# EAGLE design esp_heart (EAGLE 9.3.0)
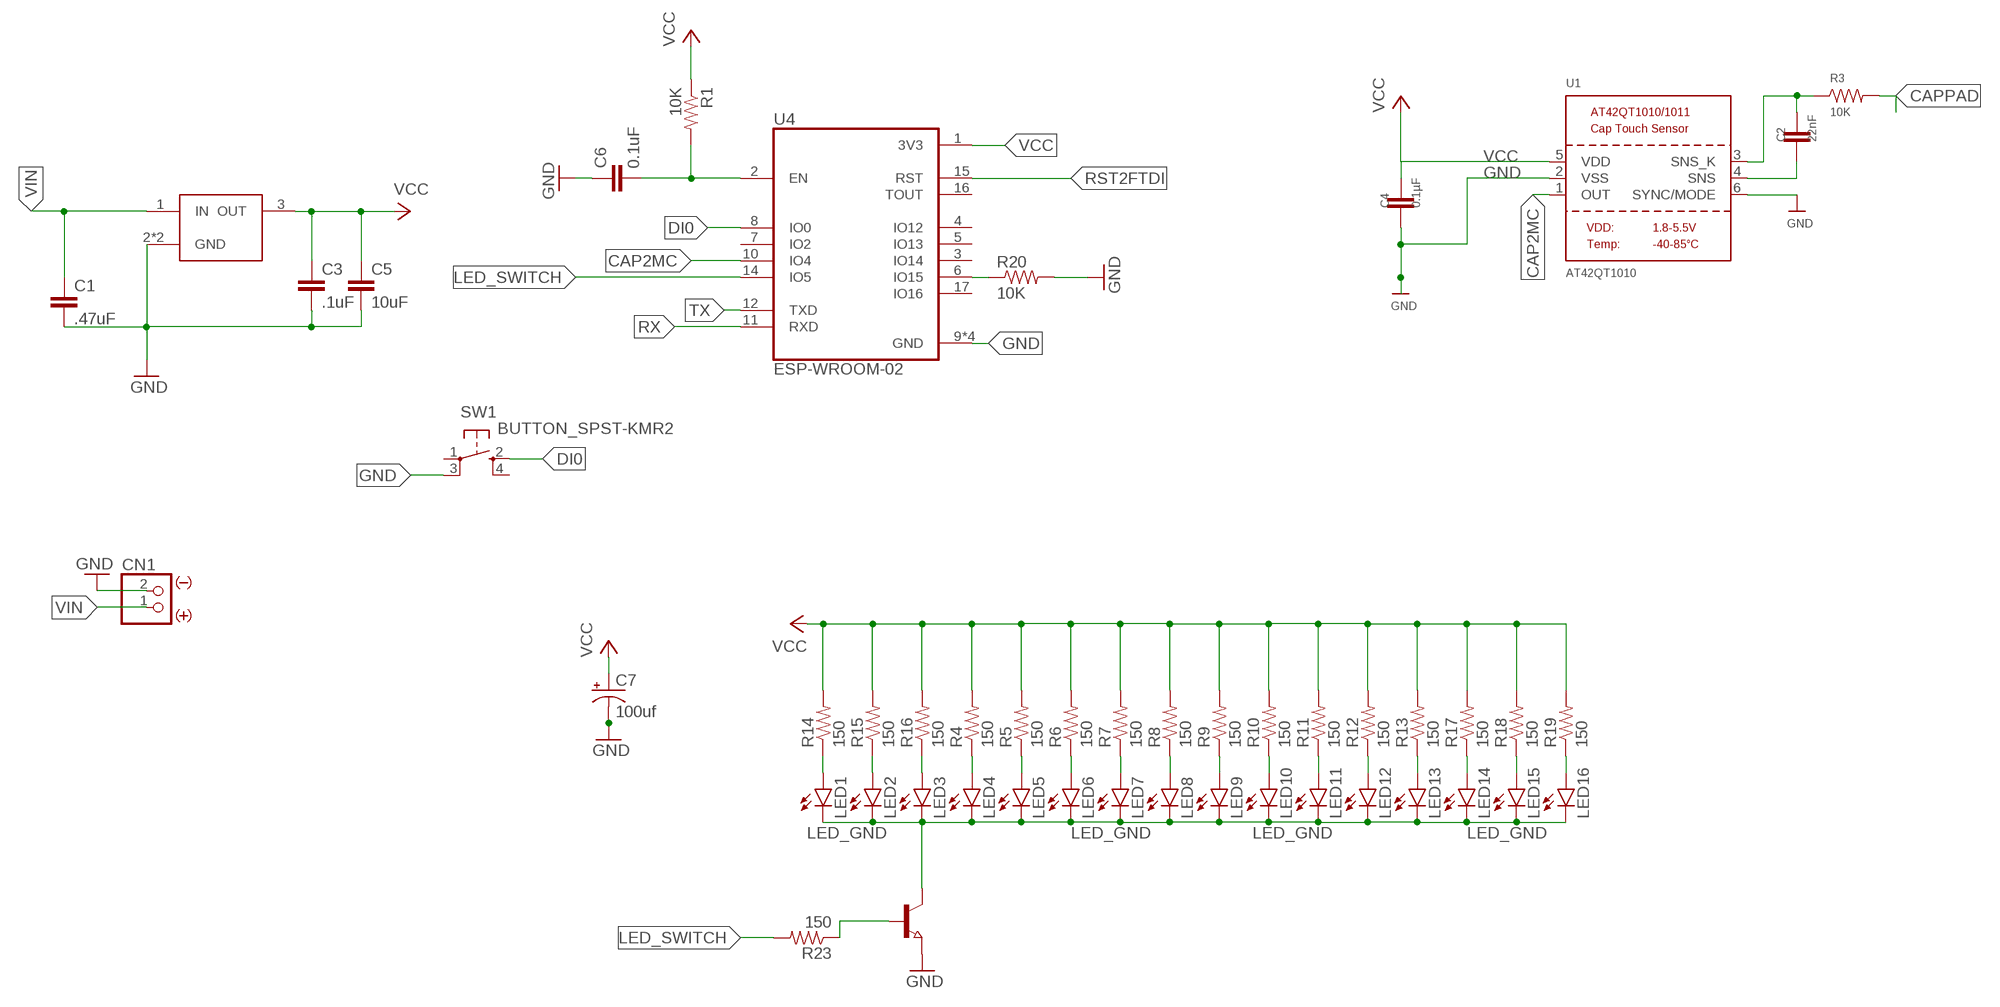
[diagram p0: schematic, sheet 1]

## Parts
C1  .47uF  CAP-0805  [0805]
C2  22nF  CAP-0805  [0805]
C3  .1uF  CAP-0805  [0805]
C4  0.1µF  CAP-0805  [0805]
C5  10uF  CAP-0805  [0805]
C6  0.1uF  CAP-0805  [0805]
C7  100uf  CAP_POLD  [PANASONIC_D]
CN1  JST_2PIN_BATTERY-SMT-HORIZ  [JST-PH-2-SMT-RA]
LED1  LED0603  [LED-0603]
LED2  LED0603  [LED-0603]
LED3  LED0603  [LED-0603]
LED4  LED0603  [LED-0603]
LED5  LED0603  [LED-0603]
LED6  LED0603  [LED-0603]
LED7  LED0603  [LED-0603]
LED8  LED0603  [LED-0603]
LED9  LED0603  [LED-0603]
LED10  LED0603  [LED-0603]
LED11  LED0603  [LED-0603]
LED12  LED0603  [LED-0603]
LED13  LED0603  [LED-0603]
LED14  LED0603  [LED-0603]
LED15  LED0603  [LED-0603]
LED16  LED0603  [LED-0603]
Q5  TRANSISTOR-NPN-SOT23  [SOT23]
R1  10K  RESISTOR-0805  [0805]
R3  10K  RESISTOR-0805  [0805]
R4  150  RESISTOR0603  [0603-RES]
R5  150  RESISTOR0603  [0603-RES]
R6  150  RESISTOR0603  [0603-RES]
R7  150  RESISTOR0603  [0603-RES]
R8  150  RESISTOR0603  [0603-RES]
R9  150  RESISTOR0603  [0603-RES]
R10  150  RESISTOR0603  [0603-RES]
R11  150  RESISTOR0603  [0603-RES]
R12  150  RESISTOR0603  [0603-RES]
R13  150  RESISTOR0603  [0603-RES]
R14  150  RESISTOR0603  [0603-RES]
R15  150  RESISTOR0603  [0603-RES]
R16  150  RESISTOR0603  [0603-RES]
R17  150  RESISTOR0603  [0603-RES]
R18  150  RESISTOR0603  [0603-RES]
R19  150  RESISTOR0603  [0603-RES]
R20  10K  RESISTOR-0805  [0805]
R23  150  RESISTOR-0805  [0805]
SW1  BUTTON_SPST-KMR2  [KMR2]
U1  AT42QT1010  AT42QT1010/1  [SOT23-6]
U4  ESP-WROOM-02  [MODULE_ESP-WROOM-02]
U$1  REGULATOR3.3V-0.5A-UA78M33CDCYR  [SOT223]

## Nets
CAP2MC: U1.1(OUT) U4.10(IO4)
CAPPAD: R3.2
DI0: SW1.2(S) U4.8(IO0)
GND: C1.2 C3.2 C4.2 C5.2 C6.1 C7.- CN1.2 Q5.2(E) R20.2 SW1.3(P1) U1.2(VSS) U1.6(SYNC/MODE) U4.9(GND) U4.13(GND) U4.18(GND) U4.19(GND) U$1.2(GND) U$1.4(GND)
LED_GND: LED1.C LED2.C LED3.C LED4.C LED5.C LED6.C LED7.C LED8.C LED9.C LED10.C LED11.C LED12.C LED13.C LED14.C LED15.C LED16.C Q5.3(C)
LED_SWITCH: R23.2 U4.14(IO5)
N$1: LED4.A R4.1
N$3: C6.2 R1.2 U4.2(EN)
N$4: LED15.A R18.1
N$5: LED1.A R14.1
N$6: LED2.A R15.1
N$7: LED5.A R5.1
N$8: LED6.A R6.1
N$9: LED7.A R7.1
N$10: LED8.A R8.1
N$11: LED9.A R9.1
N$12: LED10.A R10.1
N$13: LED11.A R11.1
N$14: LED12.A R12.1
N$15: LED13.A R13.1
N$16: LED3.A R16.1
N$18: R20.1 U4.6(IO15)
N$20: LED16.A R19.1
N$22: LED14.A R17.1
N$23: Q5.1(B) R23.1
N$26: C2.2 U1.4(SNS)
N$27: C2.1 R3.1 U1.3(SNS_K)
RST2FTDI: U4.15(RST)
RX: U4.11(RXD)
TX: U4.12(TXD)
VCC: C3.1 C4.1 C5.1 C7.+ R1.1 R4.2 R5.2 R6.2 R7.2 R8.2 R9.2 R10.2 R11.2 R12.2 R13.2 R14.2 R15.2 R16.2 R17.2 R18.2 R19.2 U1.5(VDD) U4.1(3V3) U$1.3(OUT)
VIN: C1.1 CN1.1 U$1.1(IN)
Unconnected: SW1.1(P) SW1.4(S1) U4.3(IO14) U4.4(IO12) U4.5(IO13) U4.7(IO2) U4.16(TOUT) U4.17(IO16)

## Library data of the parts
C1-C6 = homemade-hardware:CAP: Capacitor Standard 0603 ceramic capacitor, and 0.1" leaded capacitor.
C7 = homemade-hardware:CAP_POL: Capacitor Polarized These are standard SMD and PTH capacitors. Normally 10uF, 47uF, and 100uF in electrolytic and tantalum varieties. Always verify the external diameter of the through hole cap, it varies with capacity, voltage, and manufacturer. The EIA devices should be standard.
CN1 = homemade-hardware:JST_2PIN_BATTERY: JST 2-Pin Connectors of various flavors SMT-HORIZ (S2B-PH-SM4) SMT-VERT (B2B-PH-SM4) DIP-HORIZ (S2B-PH) DIP-VERT (B2B-PH)
LED1-LED16 = homemade-hardware:LED: LEDs Standard schematic elements and footprints for 5mm, 3mm, 1206, and 0603 sized LEDs. 5mm - Spark Fun Electronics SKU : COM-00529 (and others)
Q5 = homemade-hardware:TRANSISTOR-NPN: NPN Transistor BJT <https://www.digikey.com/product-detail/en/micro-commercial-co/MMBT2222A-TP/MMBT2222ATPMSCT-ND/717394>: MMBT2222A
R1 R3-R20 R23 = homemade-hardware:RESISTOR: Resistor Basic schematic elements and footprints for 0603, 1206, and PTH resistors.
SW1 = homemade-hardware:BUTTON_SPST: KMR221GLFS <https://www.digikey.com/products/en/switches/tactile-switches/197?k=KMR221GLFS&k=&pkeyword=KMR221GLFS&sv=0&pv7=2&sf=0&quantity=&ColumnSort=0&page=1&pageSize=25>: Momentary Button PTS647 <https://www.digikey.com/product-detail/en/c-k/PTS-647-SN38-SMTR2-LFS/PTS647SN38SMTR2LFSTR-ND/9649860>: Momentary Button
U1 = microbuilder:AT42QT1010/1: AT42QT1010/1011 - Single Button Cap Touch Sensors AT42QT1010 - Auto recalibration AT42QT1011 - Remains on as long as touch is detected
U4 = ESP-WROOM-02:ESP-WROOM-02: Wi-Fi Module w/ESP8266 802.11b/g/n 20dBm 20x18x3mm; AVAILABILITY: Unavailable; DESCRIPTION: Wi-Fi Module w/ESP8266 802.11b/g/n 20dBm 20x18x3mm; MF: Espressif Systems; MP: ESP-WROOM-02; PACKAGE: SMD-18 Espressif Systems; PRICE: None
U$1 = homemade-hardware:REGULATOR: MC7805CTG <https://www.digikey.com/product-detail/en/on-semiconductor/MC7805CTG/MC7805CTGOS-ND/919333>: 5V/1A DIP Linear Regulator UA78M33CDCYR <https://www.digikey.com/product-detail/en/texas-instruments/UA78M33CDCYR/296-13424-1-ND/484495>: 3.3V/0.5A SMD Linear Regulator MIC5219-5.0YM5-TR <https://www.digikey.com/products/en/integrated-circuits-ics/pmic-voltage-regulators-linear/699?k=MIC5219-5.0YM5-TR&k=&pkeyword=MIC5219-5.0YM5-TR&sv=0&pv7=2&sf=0&quantity=&ColumnSort=0&page=1&pageSize=25>: 5V/0.5A SMD Linear Regulator MIC5219-3.3YM5-TR <https://www.digikey.com/products/en/integrated-circuits-ics/pmic-voltage-regulators-linear/699?k=MIC5219-3.3YM5-TR&k=&pkeyword=MIC5219-3.3YM5-TR&sv=0&pv7=2&sf=0&quantity=&ColumnSort=0&page=1&pageSize=25>: 3.3V/0.5A SMD Linear Regulator

## Board
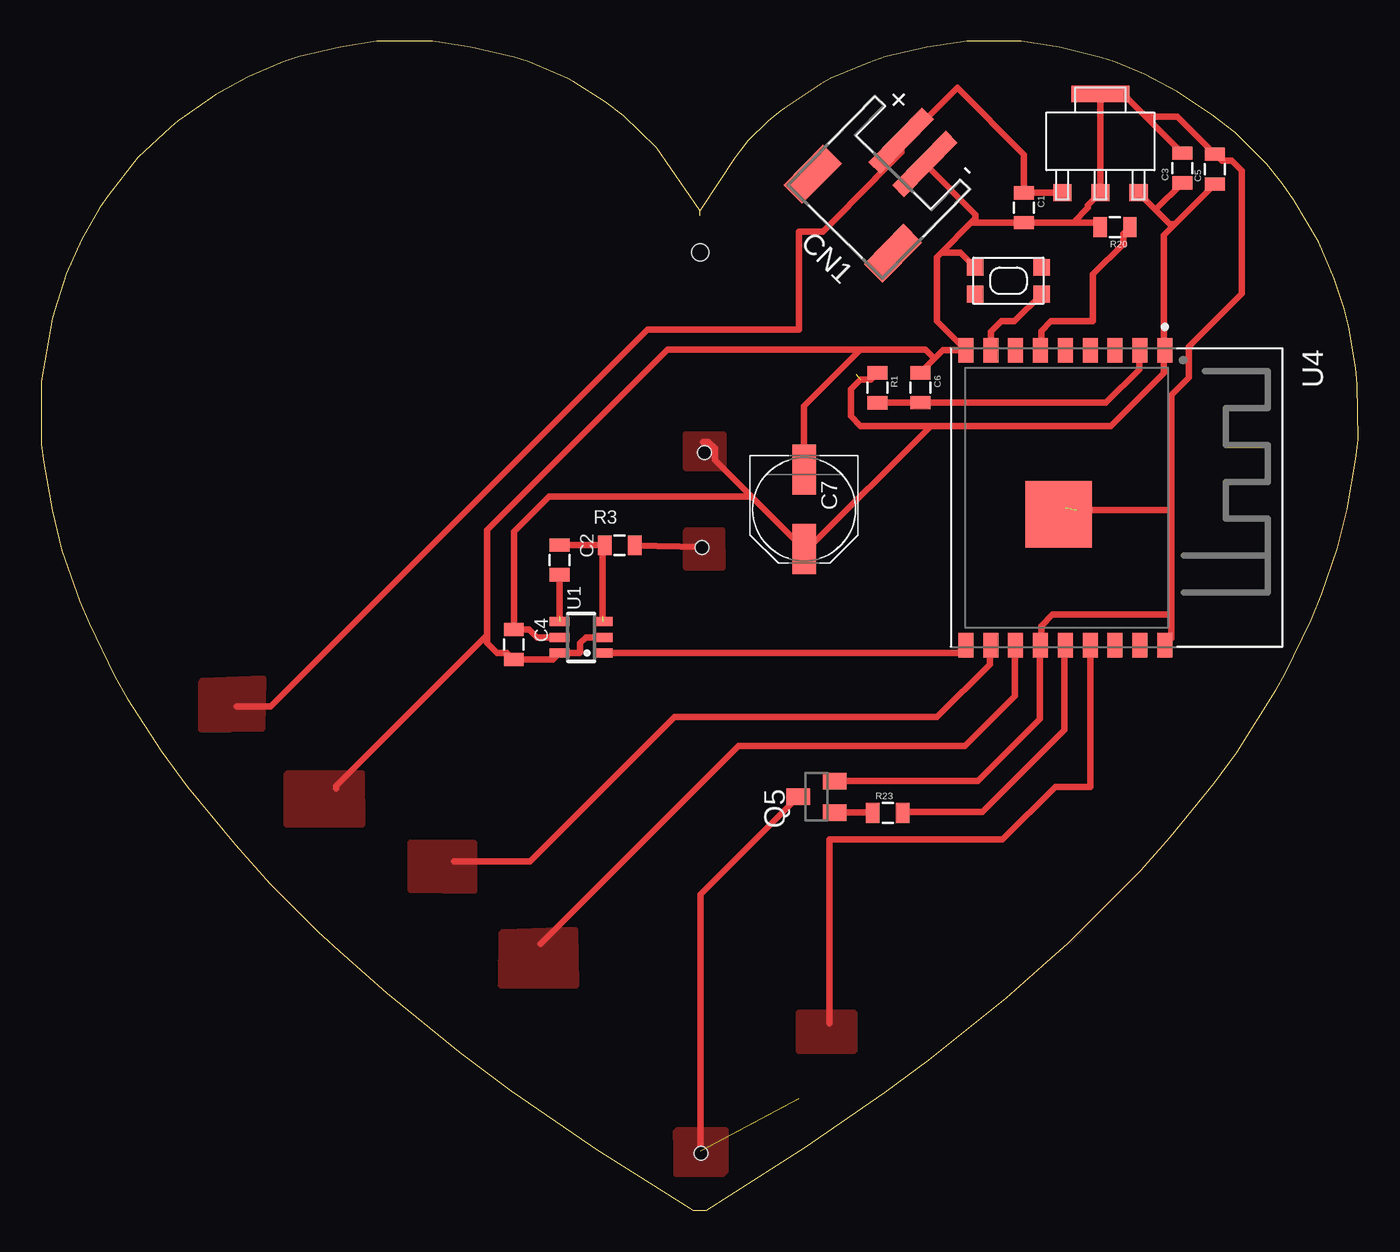
[diagram p1: board, top side]
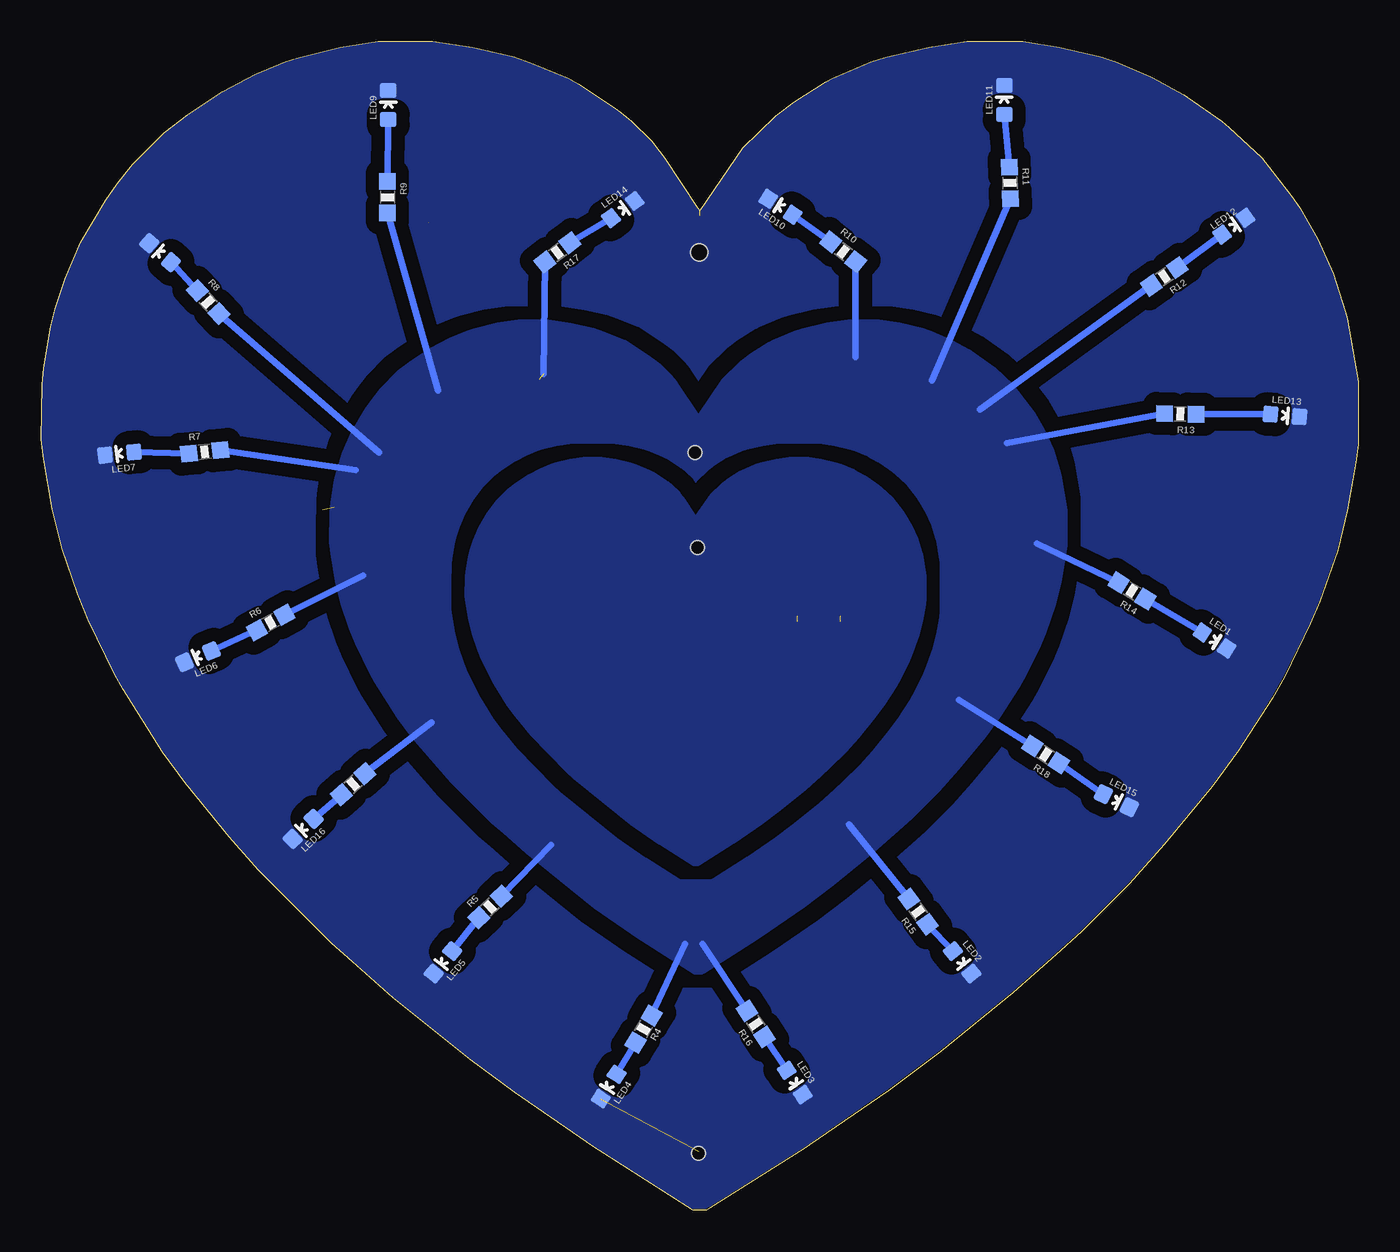
[diagram p2: board, bottom side, seen from below]

Size 79.4 x 70.5 mm. Coordinates in mm from the lower left corner, seen from the top.
Outline: 39.7,60 39.7,60.3
Outline: 39.7,60.3 37.1,64.1 35.12,66.02 33.98,66.88 32.09,68.08 31.69,68.28 29.39,69.27 28.51,69.53 25.89,70.16 23.6,70.5 20.2,70.5 18.01,70.16 15.51,69.56 14.61,69.27 12.51,68.38 12.39,68.32 10.51,67.28 10.29,67.12 8.22,65.68 7.78,65.32 5.8,63.5 4.02,61.19 3.52,60.48 2.42,58.59 1.48,56.51 0.77,54.21 0.64,53.79 0,50 0,46.2 0.14,45.1 0.63,42.21 1.23,39.81 2.32,36.71 2.88,35.39 4.42,32.22 5.18,30.89 7.22,27.72 8.78,25.58 11.67,22.08 13.8,19.7 16.7,16.8 18.22,15.43 20.82,13.12 25.18,9.58 28.32,7.22 33.12,3.92 33.41,3.72 39.11,0.12 39.19,0.08 39.3,0 40.1,0 45.78,3.62 46.02,3.78 50.88,7.12 53.52,9.08 58.18,12.82 60.62,14.97 61.9,16.1 66.3,20.5 68.08,22.52 70.72,25.78 72.08,27.62 74.48,31.42 74.98,32.32 76.58,35.61 77.22,37.19 78.14,39.89 78.77,42.31 79.25,45.3 79.4,46.5 79.34,49.8 79.25,50.8 78.84,53.31 78.56,54.39 77.98,56.19 77.02,58.41 75.52,60.92 74.82,61.92 73.9,63.1 72,65 70.58,66.08 68.49,67.48 66.51,68.52 64.69,69.27 63.91,69.53 61.39,70.16 59.1,70.5 55.8,70.5 53.39,70.14 50.91,69.56 49.89,69.23 47.61,68.28 46.99,67.92 44.82,66.48 44.48,66.22 43.8,65.7 42.6,64.5 42.12,63.88 41.82,63.48 39.82,60.48 39.7,60.3
Copper layers (1*16): Top 0.035mm / dielectric 1.5mm / Bottom 0.035mm
Design rules "default": minimum track width 16mil, minimum drill 0.8mm, track to track 0.8mm, track to pad 0.8mm, pad to pad 0.8mm, via to via 0.8mm, smd to smd 0mil, copper to edge 1mil, drill to drill 1mil, minimum pad ring 10mil, minimum via ring 10mil, stop-mask expansion 1mil, vias tented up to drill 30mil, thermal gap 10mil
Holes 0.8 mm at 39.76,3.45 39.85,39.97 39.98,45.72
Holes 1 mm at 39.73,57.77

### Footprints (pad centres in the part's own frame; a part is rotated, then mirrored left to right if it is on the bottom)
0805 = smd 0.8 x 1.2: 1 -0.9,0; 2 0.9,0
PANASONIC_D = smd 3 x 1.4: + 2.4,0; - -2.4,0
JST-PH-2-SMT-RA = smd 1 x 4.6: 1 1,-3.7; 2 -1,-3.7 | smd 1.6 x 3.4: NC1 -3.4,1.5; NC2 3.4,1.5
LED-0603 = smd 1 x 0.9: A 0,-0.877; C 0,0.877
SOT23 = smd 1 x 1.4: 1 -0.95,-1.1; 2 0.95,-1.1; 3 0,1.1
0603-RES = smd 1 x 1: 1 -0.95,0; 2 0.95,0
KMR2 = smd 1 x 1: 1 2,0.8; 2 2,-0.8; 3 -2,0.8; 4 -2,-0.8
SOT23-6 = smd 0.55 x 1.2: 1 -0.95,-1.3; 2 0,-1.3; 3 0.95,-1.3; 4 0.95,1.3; 5 0,1.3; 6 -0.95,1.3
MODULE_ESP-WROOM-02 = smd 1.485 x 0.9: 1 -8.893,4.9; 2 -8.893,3.4; 3 -8.893,1.9; 4 -8.893,0.4; 5 -8.893,-1.1; 6 -8.893,-2.6; 7 -8.893,-4.1; 8 -8.893,-5.6; 9 -8.893,-7.1; 10 8.893,-7.1; 11 8.893,-5.6; 12 8.893,-4.1; 13 8.893,-2.6; 14 8.893,-1.1; 15 8.893,0.4; 16 8.893,1.9; 17 8.893,3.4; 18 8.893,4.9 | smd 4 x 4: 19 1,-1.5
SOT223 = smd 1.1 x 1: 1 -2.3,-3.1; 2 0,-3.1; 3 2.3,-3.1 | smd 3.5 x 1: 4 0,2.85

### Placement (x,y rotation side)
C1  59.26,60.47 270 top
C2  31.24,39.23 270 top
C3  68.8,62.87 90 top
C4  28.49,34.13 270 top
C5  70.77,62.8 90 top
C6  53.02,49.62 270 top
C7  45.99,42.28 270 top
CN1  49.98,61.18 135.5 top
LED1  8.66,34.38 237 bottom
LED2  23.87,14.96 219.5 bottom
LED3  33.97,7.72 213.5 bottom
LED4  45.19,7.47 146.8 bottom
LED5  55.19,14.96 140.4 bottom
LED6  69.97,33.4 113 bottom
LED7  74.69,45.64 96.1 bottom
LED8  72.25,57.76 48.7 bottom
LED9  58.49,66.66 0 bottom
LED10  34.84,60.53 56.7 bottom
LED11  21.34,66.97 0 bottom
LED12  7.49,59.37 305.2 bottom
LED13  4.4,47.94 265 bottom
LED14  44.34,60.37 305.9 bottom
LED15  14.57,24.71 243.5 bottom
LED16  63.62,23.01 133.9 bottom
Q5  46.73,24.95 90 top
R1  50.41,49.61 270 top
R3  34.87,40.11 0 top
R4  43.09,10.94 59.4 bottom
R5  52.35,18.3 43.9 bottom
R6  65.59,35.46 28.9 bottom
R7  69.55,45.75 5.9 bottom
R8  69.35,54.78 313.1 bottom
R9  58.53,61.1 270 bottom
R10  31.05,57.82 321.6 bottom
R11  21,61.97 271.8 bottom
R12  11.68,56.33 214.3 bottom
R13  10.72,48.04 179 bottom
R14  13.63,37.37 148.7 bottom
R15  26.52,18.02 126.3 bottom
R16  36.32,11.25 123.7 bottom
R17  48.28,57.78 217.4 bottom
R18  18.84,27.49 147 bottom
R19  60.6,25.71 42.1 bottom
R20  64.74,59.3 180 top
R23  51.04,23.96 0 top
SW1  58.32,56.06 0 top
U1  32.55,34.56 90 top
U4  62.85,42.98 270 top
U$1  63.86,64.48 0 top

### Tracks (layer width: path | path; a pad name or v marks a point on that pad's centre or on a via)
CAP2MC
  Top 0.406: U4.10 55.27,33.61 U1.1
CAPPAD
  Top 0.406: R3.2 39.87,40
  pour Bottom: 26.05,38.27 26.05,36.94 26.1,36.55 26.27,35.54 26.48,34.7 26.86,33.61 27.06,33.15 27.6,32.04 27.86,31.58 28.58,30.47 29.12,29.72 30.14,28.49 30.88,27.66 31.9,26.65 32.43,26.16 33.34,25.36 34.86,24.12 35.96,23.29 37.64,22.14 37.75,22.07 39.74,20.81 39.77,20.79 39.81,20.77 40.09,20.77 42.08,22.03 42.16,22.09 43.86,23.26 47.27,26.01 47.72,26.4 49.88,28.65 50.8,29.79 51.28,30.43 52.12,31.76 52.29,32.08 52.85,33.23 53.08,33.78 53.4,34.73 53.62,35.57 53.79,36.62 53.84,37.04 53.82,38.2 53.79,38.54 53.64,39.42 53.55,39.8 53.34,40.43 53.01,41.21 52.48,42.09 52.24,42.44 51.92,42.85 51.25,43.52 50.75,43.89 50.02,44.38 49.33,44.75 48.69,45.01 48.42,45.1 47.54,45.32 46.74,45.44 45.58,45.44 44.74,45.32 43.87,45.11 43.51,45 42.71,44.66 42.5,44.54 41.74,44.03 41.62,43.94 41.38,43.76 40.96,43.34 40.79,43.12 40.69,42.98 39.99,41.93 39.95,41.87 39.04,43.2 38.34,43.87 37.94,44.17 37.28,44.59 37.14,44.66 36.34,45.01 36.03,45.1 35.11,45.32 34.31,45.44 33.12,45.44 32.35,45.32 31.48,45.11 31.16,45.01 30.43,44.7 30.39,44.68 29.73,44.31 29.65,44.26 28.93,43.75 28.77,43.63 28.08,42.99 27.46,42.18 27.28,41.93 26.9,41.27 26.57,40.54 26.32,39.74 26.27,39.59
  pour Top: 38.89,40.93 38.89,38.76 41.06,38.78 41.03,41.03 38.91,41.01
DI0
  Top 0.406: SW1.2 58.68,53.62 57.88,53.62 57.25,52.99 U4.8
GND  (2 unrouted)
  Top 0.406: U$1.4 63.86,67.09 | 63.86,67.09 U$1.2 63.11,60.63 63.11,60.47 62.22,59.57 | C3.2 66.6,65.96 | 66.6,65.96 65.47,67.09 63.86,67.09 | 66.6,65.96 68.51,65.96 C5.2 71.17,63.3 71.79,63.3 72.38,62.72 72.38,55.28 69.2,52.1 69.2,50.23 68.15,49.18 68.15,42.25 | 62.22,59.57 C1.2 56.06,59.57 54.26,57.78 | 56.06,59.58 56.34,59.85 56.34,60.06 CN1.2 | 54.26,57.78 53.99,57.5 53.99,53.63 U4.9 54.37,51.88 53.87,51.37 | 62.22,59.57 63.57,59.57 R20.2 | U4.19 61.74,42.38 | Q5.2 56.47,25.9 60.2,29.63 60.2,34.05 U4.13 60.29,34.14 60.29,35.25 60.97,35.93 68.15,35.93 | U4.18 68.15,34.5 68.15,35.93 | U1.2 32.83,34.56 32.49,34.22 32.49,33.67 32.44,33.61 U1.6 30.87,33.23 C4.2 28.09,33.63 27.47,33.63 26.89,34.21 26.89,34.71 | 53.87,51.37 C6.1 | 68.15,42.25 68.15,35.93 | SW1.3 55.41,57.78 54.26,57.78 | 49.39,51.92 45.99,48.52 C7.- | 49.39,51.92 53.32,51.92 53.87,51.37 | 26.89,34.71 26.89,41.04 37.76,51.92 49.39,51.92 | 26.89,34.71 17.77,25.59 17.77,25.45 | 68.15,42.25 62.44,42.25
  pour Top: 14.79,26.28 14.79,23.29 19.34,23.29 19.3,26.38 14.86,26.35
LED_GND  (1 unrouted)
  Top 0.406: Q5.3 39.74,19.06 39.74,3.58
  pour Bottom (rank 3, no thermals): 0.04,50.1 0.04,46.3 0.19,45.2 0.68,42.3 1.28,39.9 2.36,36.8 2.92,35.49 4.46,32.31 5.22,30.99 7.26,27.81 8.82,25.68 11.72,22.17 13.84,19.79 16.74,16.89 18.26,15.52 20.86,13.22 25.22,9.67 28.36,7.32 33.16,4.02 33.46,3.82 39.15,0.22 39.23,0.18 39.34,0.1 40.14,0.1 45.82,3.72 46.06,3.87 50.92,7.22 53.56,9.17 58.22,12.92 60.66,15.07 61.94,16.2 66.34,20.59 68.12,22.62 70.76,25.88 72.12,27.71 74.52,31.51 75.02,32.41 76.62,35.71 77.26,37.29 78.18,39.99 78.8,42.4 79.29,45.4 79.44,46.6 79.39,49.9 79.29,50.89 78.88,53.4 78.6,54.49 78.02,56.29 77.06,58.51 75.56,61.01 74.86,62.01 73.94,63.2 72.04,65.09 70.62,66.17 68.53,67.58 66.55,68.62 64.73,69.37 63.95,69.62 61.43,70.25 59.14,70.59 55.84,70.59 53.43,70.24 50.95,69.66 49.93,69.33 47.65,68.38 47.03,68.02 44.86,66.57 44.52,66.32 43.84,65.8 42.64,64.59 42.16,63.97 41.86,63.58 39.86,60.58 39.74,60.39 37.14,64.2 35.16,66.12 34.02,66.97 32.13,68.17 31.73,68.38 29.43,69.37 28.55,69.63 25.93,70.25 23.64,70.59 20.24,70.59 18.05,70.25 15.55,69.66 14.65,69.37 12.55,68.48 12.43,68.42 10.56,67.37 10.32,67.22 8.26,65.77 7.82,65.42 5.84,63.59 4.06,61.28 3.56,60.58 2.46,58.69 1.52,56.61 0.8,54.3 0.68,53.89
  pour Top: 38.3,4.2 38.3,2.24 38.27,2.21 41.1,2.21 41.26,2.37 41.26,4.82 38.36,4.82 38.27,4.73 38.27,4.32 38.33,4.26
LED_SWITCH
  Top 0.406: R23.2 51.94,24.02 56.75,24.02 61.7,28.97 61.7,34.05 U4.14
N$1
  Bottom 0.406: LED4.A R4.1
N$3
  Top 0.406: U4.2 66.2,51.83 66.2,50.72 64.2,48.72 C6.2 R1.2
N$4
  Bottom 0.406: LED15.A R18.1
N$5
  Bottom 0.406: LED1.A R14.1
N$6
  Bottom 0.406: LED2.A R15.1
N$7
  Bottom 0.406: LED5.A R5.1
N$8
  Bottom 0.406: LED6.A R6.1
N$9
  Bottom 0.406: LED7.A R7.1
N$10
  Bottom 0.406: LED8.A R8.1
N$11
  Bottom 0.406: LED9.A R9.1
N$12
  Bottom 0.406: LED10.A R10.1
N$13
  Bottom 0.406: LED11.A R11.1
N$14
  Bottom 0.406: LED12.A R12.1
N$15
  Bottom 0.406: LED13.A R13.1
N$16
  Bottom 0.406: LED3.A R16.1
N$18
  Top 0.406: 60.2,51.83 U4.6 60.29,51.92 60.29,53.04 60.88,53.62 63.42,53.62 63.42,56.46 65.25,58.28 65.25,58.9 R20.1
N$20
  Bottom 0.406: LED16.A R19.1
N$22
  Bottom 0.406: LED14.A R17.1
N$23
  Top 0.406: R23.1 50.1,24 Q5.1
N$26  (1 unrouted)
  Top 0.406: C2.2 31.24,35.85 31.25,35.84
N$27  (1 unrouted)
  Top 0.406: 33.85,35.84 33.85,39.99 R3.1 33.95,40.13 C2.1
RST2FTDI
  Top 0.406: U4.15 63.25,25.55 61.15,25.55 57.96,22.36 47.51,22.36 47.51,11.28
  pour Top: 45.69,11.85 45.69,9.62 45.7,9.62 48.99,9.62 48.99,9.65 48.99,11.92 48.95,11.92 45.7,11.92 45.7,11.86
RX
  Top 0.406: U4.11 57.2,34.05 57.2,32.93 54.02,29.75 38.17,29.75 29.47,21.05 24.9,21.05
  pour Top: 22.27,22.16 22.27,19.32 26.1,19.26 26.1,22.16 22.33,22.19
TX
  Top 0.406: U4.12 58.7,34.05 58.7,31.03 55.68,28.01 42.04,28.01 30.1,16.07
  pour Top: 27.75,16.71 27.71,13.59 32.23,13.59 32.19,16.91 27.81,16.78
VCC  (1 unrouted)
  Top 0.406: U$1.3 67.16,60.39 | 67.16,60.39 68.06,59.48 | 68.06,59.48 68.2,59.35 | C3.1 67.22,60.39 67.16,60.39 | C5.1 68.35,59.48 | 68.35,59.48 68.06,59.48 | U1.5 29.88,34.56 29.41,35.03 C4.1 28.49,40.93 30.6,43.05 42.83,43.05 | R1.1 50.01,50.12 49.39,50.12 48.8,49.53 48.8,47.9 49.39,47.31 53.63,47.31 | U4.1 67.7,51.83 | 67.7,51.83 67.7,50.51 64.5,47.31 53.63,47.31 | 68.35,59.48 67.7,58.83 67.7,51.83 | 46.51,40.4 C7.+ | C7.+ 46.2,39.88 53.63,47.31 | 39.9,46.35 40.24,46.35 40.61,45.98 40.61,45.27 42.83,43.05 | C7.+ 42.83,43.05
  Bottom 0.406: R10.2 30.3,51.49 30.31,51.48 | R11.2 25.7,50.04 | R12.2 22.82,48.3 | R13.2 21.18,46.28 | R14.2 19.36,40.22 | R18.2 24.07,30.79 | R15.2 30.7,23.28 | R16.2 39.54,16.07 | R4.2 40.6,16.07 | R5.2 48.67,22.03 | R19.2 55.88,29.44 | R6.2 60.01,38.3 | R8.2 59.05,45.7 | R9.2 55.49,49.46 | R17.2 49.13,50.44 | R7.2 60.44,44.65
  pour Bottom (rank 2): 17.56,42.24 17.56,40.11 17.64,39.5 17.91,37.88 18.25,36.53 18.86,34.8 19.17,34.06 20.03,32.28 20.46,31.54 21.6,29.76 22.47,28.57 24.1,26.6 25.28,25.27 26.91,23.65 27.76,22.88 29.22,21.59 31.66,19.6 33.42,18.29 36.1,16.44 36.27,16.32 39.46,14.31 39.5,14.28 39.56,14.24 40.01,14.24 43.2,16.27 43.33,16.36 46.05,18.23 50.14,21.52 51.51,22.72 52.22,23.35 54.69,25.82 56.7,28.11 57.16,28.68 57.92,29.71 59.26,31.83 59.54,32.34 60.44,34.18 60.8,35.07 61.31,36.58 61.67,37.93 61.94,39.61 62.02,40.28 61.99,42.13 61.94,42.69 61.71,44.09 61.55,44.7 61.23,45.71 60.69,46.95 59.85,48.35 59.46,48.91 58.94,49.58 57.88,50.64 57.08,51.24 55.91,52.03 54.8,52.61 53.78,53.03 53.35,53.18 51.94,53.53 50.65,53.72 48.8,53.72 47.46,53.52 46.07,53.2 45.5,53.01 44.22,52.48 43.87,52.28 42.66,51.47 42.47,51.33 42.09,51.03 41.41,50.36 41.15,50.01 40.98,49.79 39.86,48.11 39.79,48.01 38.33,50.14 37.22,51.21 36.59,51.69 35.53,52.36 35.3,52.48 34.02,53.03 33.52,53.18 32.06,53.53 30.77,53.72 28.87,53.72 27.64,53.53 26.24,53.2 25.74,53.03 24.56,52.53 24.5,52.5 23.45,51.92 23.32,51.83 22.16,51.02 21.91,50.82 20.8,49.8 19.81,48.5 19.53,48.11 18.91,47.05 18.39,45.89 17.99,44.6 17.91,44.36
  pour Top: 38.86,46.71 38.86,44.77 41.14,44.75 41.12,46.79 38.86,46.81
VIN
  Top 0.406: 61.5,61.32 U$1.1 59.27,61.38 C1.1 59.26,63.68 55.23,67.7 52.05,64.52 CN1.1 51.86,63.81 50.31,62.26 50.31,62.23 47.12,59.04 45.67,59.04 45.67,53.12 36.56,53.12 13.84,30.4 11.77,30.4
  pour Top: 9.64,31.8 9.64,28.99 13.31,29.06 13.38,32.09 9.7,31.93